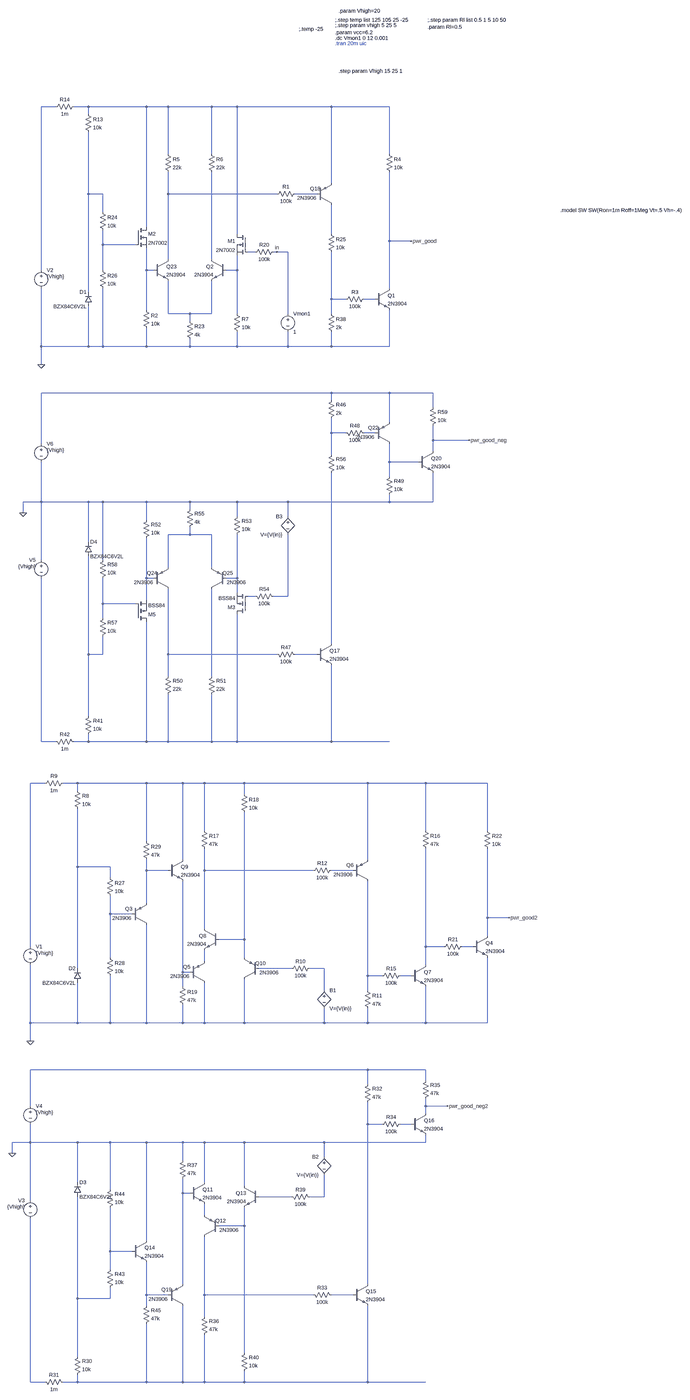
[diagram p0: schematic power_good.asc, whole sheet]
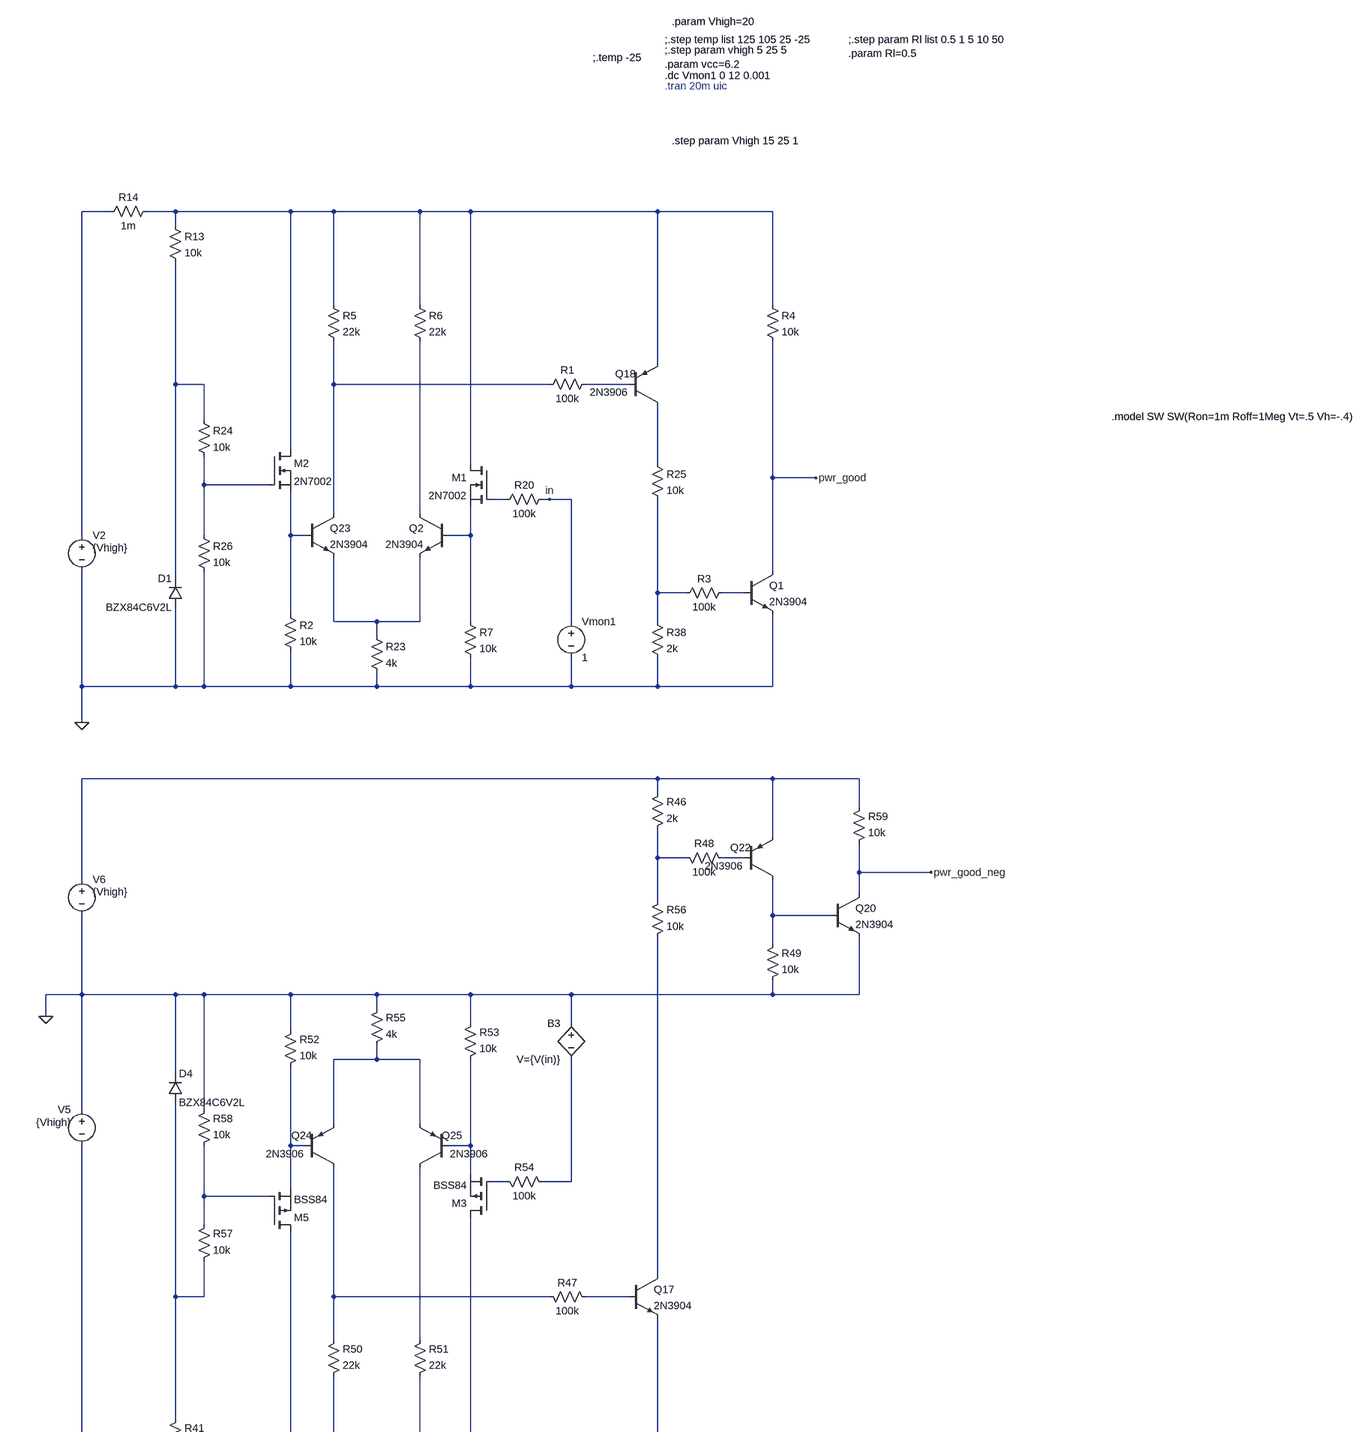
[diagram p1: schematic power_good.asc, part, row 1 of 2, column 1 of 1]
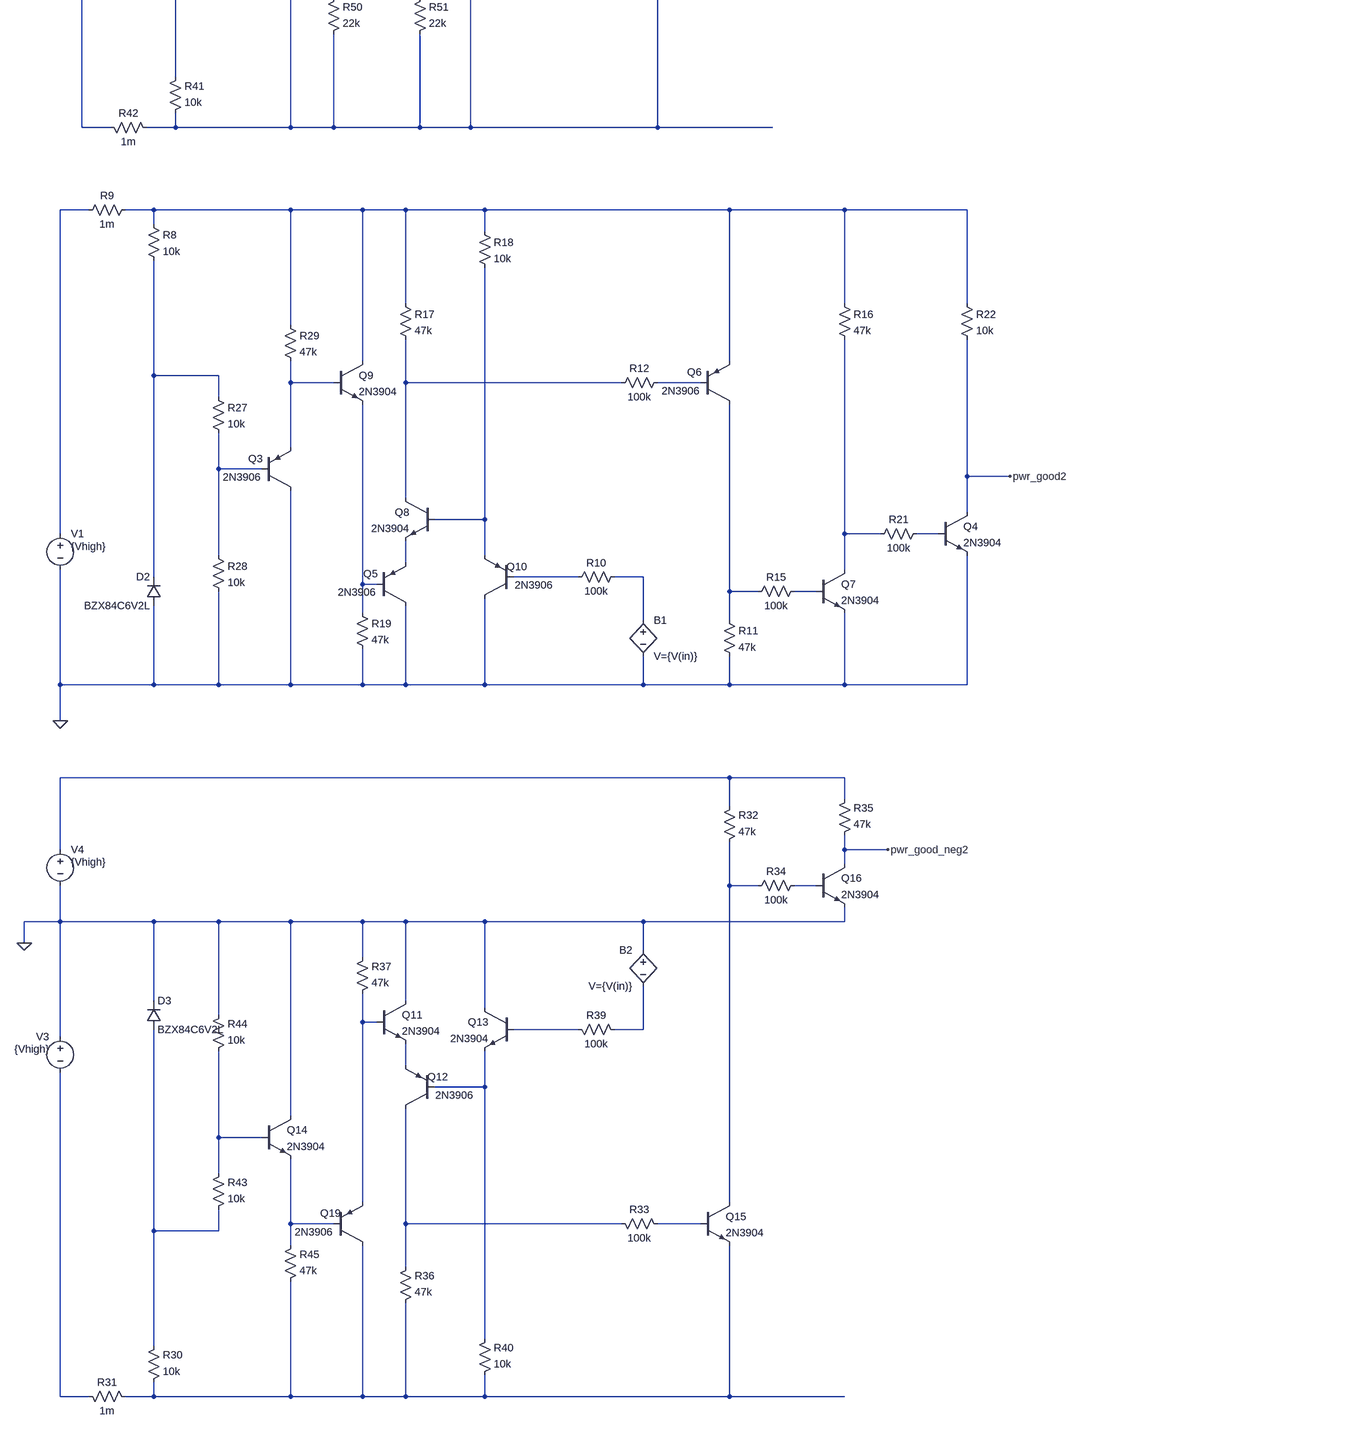
[diagram p2: schematic power_good.asc, part, row 2 of 2, column 1 of 1]
power_good.asc, the LTspice schematic file:
Version 4.1
SHEET 1 5252 5712
WIRE -1552 -416 -1616 -416
WIRE -1408 -416 -1472 -416
WIRE -1152 -416 -1408 -416
WIRE -1056 -416 -1152 -416
WIRE -864 -416 -1056 -416
WIRE -752 -416 -864 -416
WIRE -336 -416 -752 -416
WIRE -80 -416 -336 -416
WIRE -1408 -384 -1408 -416
WIRE -1056 -208 -1056 -416
WIRE -864 -208 -864 -416
WIRE -80 -208 -80 -416
WIRE -336 -80 -336 -416
WIRE -1408 -32 -1408 -304
WIRE -1344 -32 -1408 -32
WIRE -1056 -32 -1056 -128
WIRE -576 -32 -1056 -32
WIRE -400 -32 -496 -32
WIRE -1344 48 -1344 -32
WIRE -1152 112 -1152 -416
WIRE -752 144 -752 -416
WIRE -336 144 -336 16
WIRE -80 176 -80 -128
WIRE 16 176 -80 176
WIRE -1344 192 -1344 128
WIRE -1200 192 -1344 192
WIRE -672 224 -704 224
WIRE -576 224 -592 224
WIRE -528 224 -576 224
WIRE -1056 256 -1056 -32
WIRE -864 256 -864 -128
WIRE -1616 304 -1616 -416
WIRE -1344 304 -1344 192
WIRE -1152 304 -1152 208
WIRE -1120 304 -1152 304
WIRE -752 304 -752 240
WIRE -752 304 -800 304
WIRE -80 384 -80 176
WIRE -1408 400 -1408 -32
WIRE -336 432 -336 224
WIRE -272 432 -336 432
WIRE -144 432 -192 432
WIRE -1152 480 -1152 304
WIRE -1056 496 -1056 352
WIRE -960 496 -1056 496
WIRE -864 496 -864 352
WIRE -864 496 -960 496
WIRE -752 496 -752 304
WIRE -528 496 -528 224
WIRE -336 496 -336 432
WIRE -960 528 -960 496
WIRE -1616 640 -1616 384
WIRE -1408 640 -1408 464
WIRE -1408 640 -1616 640
WIRE -1344 640 -1344 384
WIRE -1344 640 -1408 640
WIRE -1152 640 -1152 560
WIRE -1152 640 -1344 640
WIRE -960 640 -960 608
WIRE -960 640 -1152 640
WIRE -752 640 -752 576
WIRE -752 640 -960 640
WIRE -528 640 -528 576
WIRE -528 640 -752 640
WIRE -336 640 -336 576
WIRE -336 640 -528 640
WIRE -80 640 -80 480
WIRE -80 640 -336 640
WIRE -1616 720 -1616 640
WIRE -336 880 -1616 880
WIRE -80 880 -336 880
WIRE 112 880 -80 880
WIRE -336 912 -336 880
WIRE 112 944 112 880
WIRE -80 1008 -80 880
WIRE -336 1056 -336 992
WIRE -272 1056 -336 1056
WIRE -144 1056 -192 1056
WIRE 112 1088 112 1024
WIRE 272 1088 112 1088
WIRE -1616 1104 -1616 880
WIRE 112 1136 112 1088
WIRE -336 1152 -336 1056
WIRE -80 1184 -80 1104
WIRE 48 1184 -80 1184
WIRE -80 1248 -80 1184
WIRE -1616 1360 -1616 1184
WIRE -1616 1360 -1696 1360
WIRE -1408 1360 -1616 1360
WIRE -1344 1360 -1408 1360
WIRE -1152 1360 -1344 1360
WIRE -960 1360 -1152 1360
WIRE -752 1360 -960 1360
WIRE -528 1360 -752 1360
WIRE -80 1360 -80 1328
WIRE -80 1360 -528 1360
WIRE 112 1360 112 1232
WIRE 112 1360 -80 1360
WIRE -960 1392 -960 1360
WIRE -1696 1408 -1696 1360
WIRE -752 1424 -752 1360
WIRE -528 1424 -528 1360
WIRE -1152 1440 -1152 1360
WIRE -960 1504 -960 1472
WIRE -960 1504 -1056 1504
WIRE -864 1504 -960 1504
WIRE -1408 1536 -1408 1360
WIRE -1616 1616 -1616 1360
WIRE -1344 1616 -1344 1360
WIRE -1056 1648 -1056 1504
WIRE -864 1648 -864 1504
WIRE -1152 1696 -1152 1520
WIRE -1120 1696 -1152 1696
WIRE -752 1696 -752 1504
WIRE -752 1696 -800 1696
WIRE -752 1760 -752 1696
WIRE -672 1776 -704 1776
WIRE -528 1776 -528 1504
WIRE -528 1776 -592 1776
WIRE -1152 1792 -1152 1696
WIRE -1344 1808 -1344 1696
WIRE -1200 1808 -1344 1808
WIRE -1344 1872 -1344 1808
WIRE -336 1984 -336 1232
WIRE -1408 2032 -1408 1600
WIRE -1344 2032 -1344 1952
WIRE -1344 2032 -1408 2032
WIRE -1056 2032 -1056 1744
WIRE -576 2032 -1056 2032
WIRE -400 2032 -496 2032
WIRE -1056 2128 -1056 2032
WIRE -864 2128 -864 1744
WIRE -1408 2304 -1408 2032
WIRE -1616 2416 -1616 1696
WIRE -1552 2416 -1616 2416
WIRE -1408 2416 -1408 2384
WIRE -1408 2416 -1472 2416
WIRE -1152 2416 -1152 1888
WIRE -1152 2416 -1408 2416
WIRE -1056 2416 -1056 2208
WIRE -1056 2416 -1152 2416
WIRE -864 2416 -864 2208
WIRE -864 2416 -1056 2416
WIRE -752 2416 -752 1856
WIRE -752 2416 -864 2416
WIRE -336 2416 -336 2080
WIRE -336 2416 -752 2416
WIRE -80 2416 -336 2416
WIRE -1600 2976 -1664 2976
WIRE -1456 2976 -1520 2976
WIRE -1152 2976 -1456 2976
WIRE -992 2976 -1152 2976
WIRE -896 2976 -992 2976
WIRE -720 2976 -896 2976
WIRE -176 2976 -720 2976
WIRE 80 2976 -176 2976
WIRE 352 2976 80 2976
WIRE -1456 3008 -1456 2976
WIRE -720 3024 -720 2976
WIRE -896 3184 -896 2976
WIRE 80 3184 80 2976
WIRE 352 3184 352 2976
WIRE -1152 3232 -1152 2976
WIRE -992 3312 -992 2976
WIRE -176 3312 -176 2976
WIRE -1456 3344 -1456 3088
WIRE -1312 3344 -1456 3344
WIRE -1152 3360 -1152 3312
WIRE -1056 3360 -1152 3360
WIRE -896 3360 -896 3264
WIRE -416 3360 -896 3360
WIRE -240 3360 -336 3360
WIRE -1312 3392 -1312 3344
WIRE -1152 3504 -1152 3360
WIRE -1312 3552 -1312 3472
WIRE -1216 3552 -1312 3552
WIRE 352 3568 352 3264
WIRE 448 3568 352 3568
WIRE -896 3616 -896 3360
WIRE 352 3648 352 3568
WIRE -720 3664 -720 3104
WIRE -720 3664 -832 3664
WIRE -1664 3696 -1664 2976
WIRE 80 3696 80 3264
WIRE 160 3696 80 3696
WIRE 288 3696 240 3696
WIRE -1312 3744 -1312 3552
WIRE -720 3744 -720 3664
WIRE -896 3760 -896 3712
WIRE 80 3776 80 3696
WIRE -1456 3792 -1456 3344
WIRE -512 3792 -656 3792
WIRE -368 3792 -432 3792
WIRE -992 3808 -992 3408
WIRE -960 3808 -992 3808
WIRE -176 3824 -176 3408
WIRE -112 3824 -176 3824
WIRE 16 3824 -32 3824
WIRE -992 3872 -992 3808
WIRE -368 3888 -368 3792
WIRE -176 3888 -176 3824
WIRE -1664 4032 -1664 3776
WIRE -1456 4032 -1456 3856
WIRE -1456 4032 -1664 4032
WIRE -1312 4032 -1312 3824
WIRE -1312 4032 -1456 4032
WIRE -1152 4032 -1152 3600
WIRE -1152 4032 -1312 4032
WIRE -992 4032 -992 3952
WIRE -992 4032 -1152 4032
WIRE -896 4032 -896 3856
WIRE -896 4032 -992 4032
WIRE -720 4032 -720 3840
WIRE -720 4032 -896 4032
WIRE -368 4032 -368 3968
WIRE -368 4032 -720 4032
WIRE -176 4032 -176 3968
WIRE -176 4032 -368 4032
WIRE 80 4032 80 3872
WIRE 80 4032 -176 4032
WIRE 352 4032 352 3744
WIRE 352 4032 80 4032
WIRE -1664 4112 -1664 4032
WIRE -176 4288 -1664 4288
WIRE 80 4288 -176 4288
WIRE 80 4336 80 4288
WIRE -176 4352 -176 4288
WIRE -1664 4448 -1664 4288
WIRE 80 4448 80 4416
WIRE 176 4448 80 4448
WIRE 80 4480 80 4448
WIRE -176 4528 -176 4432
WIRE -112 4528 -176 4528
WIRE 16 4528 -32 4528
WIRE -1664 4608 -1664 4528
WIRE -1664 4608 -1744 4608
WIRE -1456 4608 -1664 4608
WIRE -1312 4608 -1456 4608
WIRE -1152 4608 -1312 4608
WIRE -992 4608 -1152 4608
WIRE -896 4608 -992 4608
WIRE -720 4608 -896 4608
WIRE -368 4608 -720 4608
WIRE 80 4608 80 4576
WIRE 80 4608 -368 4608
WIRE -1744 4656 -1744 4608
WIRE -368 4672 -368 4608
WIRE -992 4688 -992 4608
WIRE -1456 4784 -1456 4608
WIRE -896 4784 -896 4608
WIRE -720 4800 -720 4608
WIRE -1312 4816 -1312 4608
WIRE -992 4832 -992 4768
WIRE -960 4832 -992 4832
WIRE -512 4848 -656 4848
WIRE -368 4848 -368 4752
WIRE -368 4848 -432 4848
WIRE -1664 4864 -1664 4608
WIRE -896 4928 -896 4880
WIRE -720 4976 -720 4896
WIRE -720 4976 -832 4976
WIRE -1152 5040 -1152 4608
WIRE -1312 5088 -1312 4896
WIRE -1216 5088 -1312 5088
WIRE -1312 5168 -1312 5088
WIRE -992 5232 -992 4832
WIRE -176 5232 -176 4528
WIRE -1152 5280 -1152 5136
WIRE -1056 5280 -1152 5280
WIRE -896 5280 -896 5024
WIRE -416 5280 -896 5280
WIRE -240 5280 -336 5280
WIRE -1456 5296 -1456 4848
WIRE -1312 5296 -1312 5248
WIRE -1312 5296 -1456 5296
WIRE -1152 5328 -1152 5280
WIRE -896 5376 -896 5280
WIRE -720 5536 -720 4976
WIRE -1456 5552 -1456 5296
WIRE -1664 5664 -1664 4944
WIRE -1600 5664 -1664 5664
WIRE -1456 5664 -1456 5632
WIRE -1456 5664 -1520 5664
WIRE -1152 5664 -1152 5408
WIRE -1152 5664 -1456 5664
WIRE -992 5664 -992 5328
WIRE -992 5664 -1152 5664
WIRE -896 5664 -896 5456
WIRE -896 5664 -992 5664
WIRE -720 5664 -720 5616
WIRE -720 5664 -896 5664
WIRE -176 5664 -176 5328
WIRE -176 5664 -720 5664
WIRE 80 5664 -176 5664
FLAG -1616 720 0
FLAG 16 176 pwr_good
FLAG -1664 4112 0
FLAG -576 224 in
FLAG 448 3568 pwr_good2
FLAG -1744 4656 0
FLAG 176 4448 pwr_good_neg2
FLAG -1696 1408 0
FLAG 272 1088 pwr_good_neg
SYMBOL voltage -1616 288 R0
WINDOW 3 24 44 Left 2
WINDOW 123 0 0 Left 0
WINDOW 39 0 0 Left 0
SYMATTR Value {Vhigh}
SYMATTR InstName V2
SYMBOL diode -1392 464 R180
WINDOW 0 24 64 Left 2
WINDOW 3 24 0 Left 2
SYMATTR InstName D1
SYMATTR Value BZX84C6V2L
SYMBOL res -1424 -400 R0
SYMATTR InstName R13
SYMATTR Value 10k
SYMBOL res -1568 -400 R270
WINDOW 0 32 56 VTop 2
WINDOW 3 0 56 VBottom 2
SYMATTR InstName R14
SYMATTR Value 1m
SYMBOL npn -1120 256 R0
SYMATTR InstName Q23
SYMATTR Value 2N3904
SYMBOL pnp -400 16 M180
WINDOW 0 -30 71 Left 2
WINDOW 3 -87 30 Left 2
SYMATTR InstName Q18
SYMATTR Value 2N3906
SYMBOL res -352 480 R0
SYMATTR InstName R38
SYMATTR Value 2k
SYMBOL voltage -528 480 R0
SYMATTR InstName Vmon1
SYMATTR Value 1
SYMBOL res -480 -48 R90
WINDOW 0 0 56 VBottom 2
WINDOW 3 32 56 VTop 2
SYMATTR InstName R1
SYMATTR Value 100k
SYMBOL npn -144 384 R0
SYMATTR InstName Q1
SYMATTR Value 2N3904
SYMBOL res -176 416 R90
WINDOW 0 0 56 VBottom 2
WINDOW 3 32 56 VTop 2
SYMATTR InstName R3
SYMATTR Value 100k
SYMBOL res -96 -224 R0
SYMATTR InstName R4
SYMATTR Value 10k
SYMBOL npn -800 256 M0
SYMATTR InstName Q2
SYMATTR Value 2N3904
SYMBOL res -1072 -224 R0
SYMATTR InstName R5
SYMATTR Value 22k
SYMBOL res -880 -224 R0
SYMATTR InstName R6
SYMATTR Value 22k
SYMBOL res -1168 464 R0
SYMATTR InstName R2
SYMATTR Value 10k
SYMBOL res -768 480 R0
SYMATTR InstName R7
SYMATTR Value 10k
SYMBOL voltage -1664 3680 R0
WINDOW 3 24 44 Left 2
WINDOW 123 0 0 Left 0
WINDOW 39 0 0 Left 0
SYMATTR Value {Vhigh}
SYMATTR InstName V1
SYMBOL diode -1440 3856 R180
WINDOW 0 24 64 Left 2
WINDOW 3 24 0 Left 2
SYMATTR InstName D2
SYMATTR Value BZX84C6V2L
SYMBOL res -1472 2992 R0
SYMATTR InstName R8
SYMATTR Value 10k
SYMBOL res -1616 2992 R270
WINDOW 0 32 56 VTop 2
WINDOW 3 0 56 VBottom 2
SYMATTR InstName R9
SYMATTR Value 1m
SYMBOL pnp -240 3408 M180
WINDOW 0 -30 71 Left 2
WINDOW 3 -87 30 Left 2
SYMATTR InstName Q6
SYMATTR Value 2N3906
SYMBOL res -192 3872 R0
SYMATTR InstName R11
SYMATTR Value 47k
SYMBOL res -320 3344 R90
WINDOW 0 0 56 VBottom 2
WINDOW 3 32 56 VTop 2
SYMATTR InstName R12
SYMATTR Value 100k
SYMBOL npn 16 3776 R0
SYMATTR InstName Q7
SYMATTR Value 2N3904
SYMBOL res -16 3808 R90
WINDOW 0 0 56 VBottom 2
WINDOW 3 32 56 VTop 2
SYMATTR InstName R15
SYMATTR Value 100k
SYMBOL res 64 3168 R0
SYMATTR InstName R16
SYMATTR Value 47k
SYMBOL npn -832 3616 M0
SYMATTR InstName Q8
SYMATTR Value 2N3904
SYMBOL res -912 3168 R0
SYMATTR InstName R17
SYMATTR Value 47k
SYMBOL npn -1056 3312 R0
SYMATTR InstName Q9
SYMATTR Value 2N3904
SYMBOL res -1008 3856 R0
SYMATTR InstName R19
SYMATTR Value 47k
SYMBOL pnp -960 3856 M180
WINDOW 0 -30 71 Left 2
WINDOW 3 -87 30 Left 2
SYMATTR InstName Q5
SYMATTR Value 2N3906
SYMBOL bv -368 3872 R0
SYMATTR InstName B1
SYMATTR Value V={V(in)}
SYMBOL res -416 3776 R90
WINDOW 0 0 56 VBottom 2
WINDOW 3 32 56 VTop 2
SYMATTR InstName R10
SYMATTR Value 100k
SYMBOL pnp -656 3840 R180
WINDOW 0 -30 71 Left 2
WINDOW 3 -87 30 Left 2
SYMATTR InstName Q10
SYMATTR Value 2N3906
SYMBOL res -736 3008 R0
SYMATTR InstName R18
SYMATTR Value 10k
SYMBOL nmos -704 144 M0
SYMATTR InstName M1
SYMATTR Value 2N7002
SYMBOL nmos -1200 112 R0
SYMATTR InstName M2
SYMATTR Value 2N7002
SYMBOL res -576 208 R90
WINDOW 0 0 56 VBottom 2
WINDOW 3 32 56 VTop 2
SYMATTR InstName R20
SYMATTR Value 100k
SYMBOL npn 288 3648 R0
SYMATTR InstName Q4
SYMATTR Value 2N3904
SYMBOL res 256 3680 R90
WINDOW 0 0 56 VBottom 2
WINDOW 3 32 56 VTop 2
SYMATTR InstName R21
SYMATTR Value 100k
SYMBOL res 336 3168 R0
SYMATTR InstName R22
SYMATTR Value 10k
SYMBOL res -976 512 R0
SYMATTR InstName R23
SYMATTR Value 4k
SYMBOL res -352 128 R0
SYMATTR InstName R25
SYMATTR Value 10k
SYMBOL res -1360 32 R0
SYMATTR InstName R24
SYMATTR Value 10k
SYMBOL res -1360 288 R0
SYMATTR InstName R26
SYMATTR Value 10k
SYMBOL res -1328 3376 R0
SYMATTR InstName R27
SYMATTR Value 10k
SYMBOL res -1328 3728 R0
SYMATTR InstName R28
SYMATTR Value 10k
SYMBOL res -1168 3216 R0
SYMATTR InstName R29
SYMATTR Value 47k
SYMBOL pnp -1216 3600 M180
WINDOW 0 -30 71 Left 2
WINDOW 3 -87 30 Left 2
SYMATTR InstName Q3
SYMATTR Value 2N3906
SYMBOL voltage -1664 4848 M0
WINDOW 3 24 44 Left 2
WINDOW 123 0 0 Left 0
WINDOW 39 0 0 Left 0
SYMATTR Value {Vhigh}
SYMATTR InstName V3
SYMBOL diode -1472 4848 M180
WINDOW 0 24 64 Left 2
WINDOW 3 24 0 Left 2
SYMATTR InstName D3
SYMATTR Value BZX84C6V2L
SYMBOL res -1472 5648 M180
WINDOW 0 36 76 Left 2
WINDOW 3 36 40 Left 2
SYMATTR InstName R30
SYMATTR Value 10k
SYMBOL res -1616 5648 M90
WINDOW 0 0 56 VBottom 2
WINDOW 3 32 56 VTop 2
SYMATTR InstName R31
SYMATTR Value 1m
SYMBOL res -192 4448 M180
WINDOW 0 36 76 Left 2
WINDOW 3 36 40 Left 2
SYMATTR InstName R32
SYMATTR Value 47k
SYMBOL res -320 5296 M270
WINDOW 0 32 56 VTop 2
WINDOW 3 0 56 VBottom 2
SYMATTR InstName R33
SYMATTR Value 100k
SYMBOL res -912 5472 M180
WINDOW 0 36 76 Left 2
WINDOW 3 36 40 Left 2
SYMATTR InstName R36
SYMATTR Value 47k
SYMBOL npn -1216 5040 R0
SYMATTR InstName Q14
SYMATTR Value 2N3904
SYMBOL res -1008 4784 M180
WINDOW 0 36 76 Left 2
WINDOW 3 36 40 Left 2
SYMATTR InstName R37
SYMATTR Value 47k
SYMBOL bv -368 4656 M0
SYMATTR InstName B2
SYMATTR Value V={V(in)}
SYMBOL res -416 4864 M270
WINDOW 0 32 56 VTop 2
WINDOW 3 0 56 VBottom 2
SYMATTR InstName R39
SYMATTR Value 100k
SYMBOL res -736 5632 M180
WINDOW 0 36 76 Left 2
WINDOW 3 36 40 Left 2
SYMATTR InstName R40
SYMATTR Value 10k
SYMBOL res -1328 5264 M180
WINDOW 0 36 76 Left 2
WINDOW 3 36 40 Left 2
SYMATTR InstName R43
SYMATTR Value 10k
SYMBOL res -1328 4912 M180
WINDOW 0 36 76 Left 2
WINDOW 3 36 40 Left 2
SYMATTR InstName R44
SYMATTR Value 10k
SYMBOL res -1168 5424 M180
WINDOW 0 36 76 Left 2
WINDOW 3 36 40 Left 2
SYMATTR InstName R45
SYMATTR Value 47k
SYMBOL pnp -1056 5328 M180
WINDOW 0 -30 71 Left 2
WINDOW 3 -87 30 Left 2
SYMATTR InstName Q19
SYMATTR Value 2N3906
SYMBOL npn -960 4784 R0
SYMATTR InstName Q11
SYMATTR Value 2N3904
SYMBOL pnp -832 5024 R180
WINDOW 0 -30 71 Left 2
WINDOW 3 -87 30 Left 2
SYMATTR InstName Q12
SYMATTR Value 2N3906
SYMBOL npn -656 4800 M0
SYMATTR InstName Q13
SYMATTR Value 2N3904
SYMBOL npn -240 5232 R0
SYMATTR InstName Q15
SYMATTR Value 2N3904
SYMBOL voltage -1664 4432 R0
WINDOW 3 24 44 Left 2
WINDOW 123 0 0 Left 0
WINDOW 39 0 0 Left 0
SYMATTR Value {Vhigh}
SYMATTR InstName V4
SYMBOL npn 16 4480 R0
SYMATTR InstName Q16
SYMATTR Value 2N3904
SYMBOL res -16 4512 R90
WINDOW 0 0 56 VBottom 2
WINDOW 3 32 56 VTop 2
SYMATTR InstName R34
SYMATTR Value 100k
SYMBOL res 64 4432 M180
WINDOW 0 36 76 Left 2
WINDOW 3 36 40 Left 2
SYMATTR InstName R35
SYMATTR Value 47k
SYMBOL voltage -1616 1600 M0
WINDOW 3 24 44 Left 2
WINDOW 123 0 0 Left 0
WINDOW 39 0 0 Left 0
SYMATTR Value {Vhigh}
SYMATTR InstName V5
SYMBOL diode -1424 1600 M180
WINDOW 0 24 64 Left 2
WINDOW 3 24 0 Left 2
SYMATTR InstName D4
SYMATTR Value BZX84C6V2L
SYMBOL res -1424 2400 M180
WINDOW 0 36 76 Left 2
WINDOW 3 36 40 Left 2
SYMATTR InstName R41
SYMATTR Value 10k
SYMBOL res -1568 2400 M90
WINDOW 0 0 56 VBottom 2
WINDOW 3 32 56 VTop 2
SYMATTR InstName R42
SYMATTR Value 1m
SYMBOL res -352 1008 M180
WINDOW 0 36 76 Left 2
WINDOW 3 36 40 Left 2
SYMATTR InstName R46
SYMATTR Value 2k
SYMBOL res -480 2048 M270
WINDOW 0 32 56 VTop 2
WINDOW 3 0 56 VBottom 2
SYMATTR InstName R47
SYMATTR Value 100k
SYMBOL res -176 1072 M270
WINDOW 0 32 56 VTop 2
WINDOW 3 0 56 VBottom 2
SYMATTR InstName R48
SYMATTR Value 100k
SYMBOL res -96 1344 M180
WINDOW 0 36 76 Left 2
WINDOW 3 36 40 Left 2
SYMATTR InstName R49
SYMATTR Value 10k
SYMBOL res -1072 2224 M180
WINDOW 0 36 76 Left 2
WINDOW 3 36 40 Left 2
SYMATTR InstName R50
SYMATTR Value 22k
SYMBOL res -880 2224 M180
WINDOW 0 36 76 Left 2
WINDOW 3 36 40 Left 2
SYMATTR InstName R51
SYMATTR Value 22k
SYMBOL res -1168 1536 M180
WINDOW 0 36 76 Left 2
WINDOW 3 36 40 Left 2
SYMATTR InstName R52
SYMATTR Value 10k
SYMBOL res -768 1520 M180
WINDOW 0 36 76 Left 2
WINDOW 3 36 40 Left 2
SYMATTR InstName R53
SYMATTR Value 10k
SYMBOL res -576 1792 M270
WINDOW 0 32 56 VTop 2
WINDOW 3 0 56 VBottom 2
SYMATTR InstName R54
SYMATTR Value 100k
SYMBOL res -976 1488 M180
WINDOW 0 36 76 Left 2
WINDOW 3 36 40 Left 2
SYMATTR InstName R55
SYMATTR Value 4k
SYMBOL res -352 1248 M180
WINDOW 0 36 76 Left 2
WINDOW 3 36 40 Left 2
SYMATTR InstName R56
SYMATTR Value 10k
SYMBOL res -1360 1968 M180
WINDOW 0 36 76 Left 2
WINDOW 3 36 40 Left 2
SYMATTR InstName R57
SYMATTR Value 10k
SYMBOL res -1360 1712 M180
WINDOW 0 36 76 Left 2
WINDOW 3 36 40 Left 2
SYMATTR InstName R58
SYMATTR Value 10k
SYMBOL bv -528 1408 M0
SYMATTR InstName B3
SYMATTR Value V={V(in)}
SYMBOL pnp -1120 1744 M180
WINDOW 0 -30 71 Left 2
WINDOW 3 -87 30 Left 2
SYMATTR InstName Q24
SYMATTR Value 2N3906
SYMBOL pnp -800 1744 R180
WINDOW 0 -30 71 Left 2
WINDOW 3 -87 30 Left 2
SYMATTR InstName Q25
SYMATTR Value 2N3906
SYMBOL npn -400 1984 R0
SYMATTR InstName Q17
SYMATTR Value 2N3904
SYMBOL pnp -144 1104 M180
WINDOW 0 -30 71 Left 2
WINDOW 3 -87 30 Left 2
SYMATTR InstName Q22
SYMATTR Value 2N3906
SYMBOL pmos -1200 1888 M180
SYMATTR InstName M5
SYMATTR Value BSS84
SYMBOL pmos -704 1856 R180
SYMATTR InstName M3
SYMATTR Value BSS84
SYMBOL voltage -1616 1088 R0
WINDOW 3 24 44 Left 2
WINDOW 123 0 0 Left 0
WINDOW 39 0 0 Left 0
SYMATTR Value {Vhigh}
SYMATTR InstName V6
SYMBOL npn 48 1136 R0
SYMATTR InstName Q20
SYMATTR Value 2N3904
SYMBOL res 96 1040 M180
WINDOW 0 36 76 Left 2
WINDOW 3 36 40 Left 2
SYMATTR InstName R59
SYMATTR Value 10k
TEXT -320 -792 Left 2 !.dc Vmon1 0 12 0.001
TEXT -320 -848 Left 2 !;.step param vhigh 5 25 5\n.param vcc=6.2
TEXT -320 -872 Left 2 !;.step temp list 125 105 25 -25
TEXT -320 -768 Left 2 ;.tran 20m uic
TEXT -304 -912 Left 2 !.param Vhigh=20
TEXT 88 -872 Left 2 !;.step param Rl list 0.5 1 5 10 50\n.param Rl=0.5
TEXT 3656 40 Left 2 !.model SW SW(Ron=1m Roff=1Meg Vt=.5 Vh=-.4)
TEXT -480 -832 Left 2 !;.temp -25
TEXT -304 -632 Left 2 !.step param Vhigh 15 25 1

The netlist it stands for:
* power_good.asc
V2 N001 0 {Vhigh}
D1 0 N003 BZX84C6V2L
R13 N002 N003 10k
R14 N001 N002 1m
Q23 N004 N010 N014 0 2N3904
Q18 N006 N005 N002 0 2N3906
R38 N012 0 2k
Vmon1 in 0 1
R1 N005 N004 100k
Q1 pwr_good N013 0 0 2N3904
R3 N013 N012 100k
R4 N002 pwr_good 10k
Q2 N009 N011 N014 0 2N3904
R5 N002 N004 22k
R6 N002 N009 22k
R2 N010 0 10k
R7 N011 0 10k
V1 N032 0 {Vhigh}
D2 0 N034 BZX84C6V2L
R8 N033 N034 10k
R9 N032 N033 1m
Q6 N046 N037 N033 0 2N3906
R11 N046 0 47k
R12 N037 N036 100k
Q7 N040 N047 0 0 2N3904
R15 N047 N046 100k
R16 N033 N040 47k
Q8 N036 N039 N042 0 2N3904
R17 N033 N036 47k
Q9 N033 N035 N045 0 2N3904
R19 N045 0 47k
Q5 0 N045 N042 0 2N3906
B1 N044 0 V={V(in)}
R10 N044 N043 100k
Q10 0 N043 N039 0 2N3906
R18 N033 N039 10k
M1 N002 N008 N011 N011 2N7002
M2 N002 N007 N010 N010 2N7002
R20 in N008 100k
Q4 pwr_good2 N041 0 0 2N3904
R21 N041 N040 100k
R22 N033 pwr_good2 10k
R23 N014 0 4k
R25 N006 N012 10k
R24 N003 N007 10k
R26 N007 0 10k
R27 N034 N038 10k
R28 N038 0 10k
R29 N033 N035 47k
Q3 0 N038 N035 0 2N3906
V3 0 N061 {Vhigh}
D3 N060 0 BZX84C6V2L
R30 N062 N060 10k
R31 N061 N062 1m
R32 N049 N048 47k
R33 N059 N058 100k
R36 N062 N058 47k
Q14 0 N056 N057 0 2N3904
R37 N051 0 47k
B2 0 N053 V={V(in)}
R39 N053 N052 100k
R40 N062 N055 10k
R43 N060 N056 10k
R44 N056 0 10k
R45 N062 N057 47k
Q19 N062 N057 N051 0 2N3906
Q11 0 N051 N054 0 2N3904
Q12 N058 N055 N054 0 2N3906
Q13 0 N052 N055 0 2N3904
Q15 N049 N059 N062 0 2N3904
V4 N048 0 {Vhigh}
Q16 pwr_good_neg2 N050 0 0 2N3904
R34 N050 N049 100k
R35 pwr_good_neg2 N048 47k
V5 0 N030 {Vhigh}
D4 N026 0 BZX84C6V2L
R41 N031 N026 10k
R42 N030 N031 1m
R46 N016 N015 2k
R47 N028 N027 100k
R48 N017 N016 100k
R49 0 N018 10k
R50 N031 N027 22k
R51 N031 N029 22k
R52 N020 0 10k
R53 N021 0 10k
R54 N023 N022 100k
R55 N019 0 4k
R56 N025 N016 10k
R57 N026 N024 10k
R58 N024 0 10k
B3 0 N023 V={V(in)}
Q24 N027 N020 N019 0 2N3906
Q25 N029 N021 N019 0 2N3906
Q17 N025 N028 N031 0 2N3904
Q22 N018 N017 N015 0 2N3906
M5 N031 N024 N020 N020 BSS84
M3 N031 N022 N021 N021 BSS84
V6 N015 0 {Vhigh}
Q20 pwr_good_neg N018 0 0 2N3904
R59 pwr_good_neg N015 10k
.model D D
.lib standard.dio
.model NPN NPN
.model PNP PNP
.lib standard.bjt
.model NMOS NMOS
.model PMOS PMOS
.lib standard.mos
.dc Vmon1 0 12 0.001
;.step param vhigh 5 25 5
.param vcc=6.2
;.step temp list 125 105 25 -25
* .tran 20m uic
.param Vhigh=20
;.step param Rl list 0.5 1 5 10 50
.param Rl=0.5
.model SW SW(Ron=1m Roff=1Meg Vt=.5 Vh=-.4)
;.temp -25
.step param Vhigh 15 25 1
.backanno
.end